# Altium schematic sheet Title-Page.SchDoc
size A4; SheetNumber: 1; SheetTotal: 9
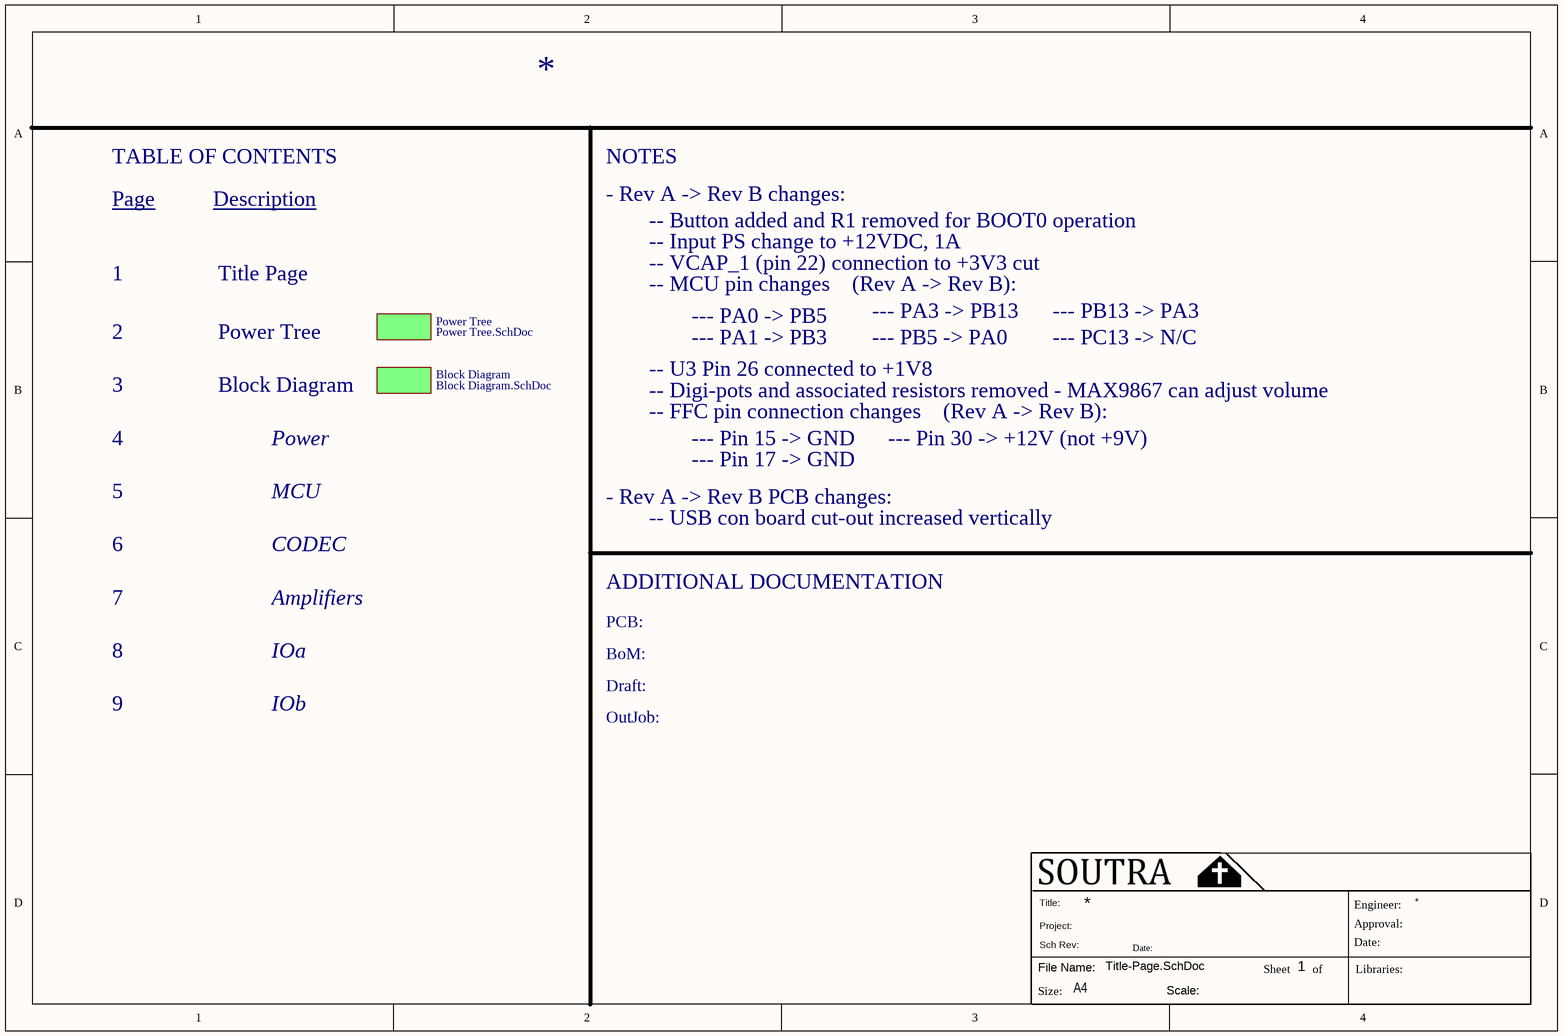
[diagram p0: Title-Page.SchDoc]

## Sub-sheets
Block Diagram = Block Diagram.SchDoc: no entries
Power Tree = Power Tree.SchDoc: no entries

## Notes on the sheet
- TABLE OF CONTENTS
- NOTES
- Page
- Description
- - Rev A -> Rev B changes:
- -- Button added and R1 removed for BOOT0 operation
- 1
- Title Page
- -- Input PS change to +12VDC, 1A
- -- VCAP_1 (pin 22) connection to +3V3 cut
- -- MCU pin changes    (Rev A -> Rev B):
- 2
- Power Tree
- -- U3 Pin 26 connected to +1V8
- --- PA0 -> PB5
- --- PA1 -> PB3
- --- PA3 -> PB13
- --- PB5 -> PA0
- --- PB13 -> PA3
- --- PC13 -> N/C
- 3
- 4
- Block Diagram
- Power
- -- Digi-pots and associated resistors removed - MAX9867 can adjust volume
- -- FFC pin connection changes    (Rev A -> Rev B):
- --- Pin 15 -> GND
- --- Pin 30 -> +12V (not +9V)
- 5
- MCU
- - Rev A -> Rev B PCB changes:
- --- Pin 17 -> GND
- 6
- CODEC
- -- USB con board cut-out increased vertically
- 7
- Amplifiers
- ADDITIONAL DOCUMENTATION
- PCB:
- 8
- 9
- IOa
- IOb
- BoM:
- Draft:
- OutJob:
- Title:
- Engineer:
- File Name:
- Size:
- Project:
- Sch Rev:
- Date:
- Scale:
- Sheet
- of
- Approval:
- Libraries:
- A4